# EAGLE design single84 (EAGLE 6.6.0)
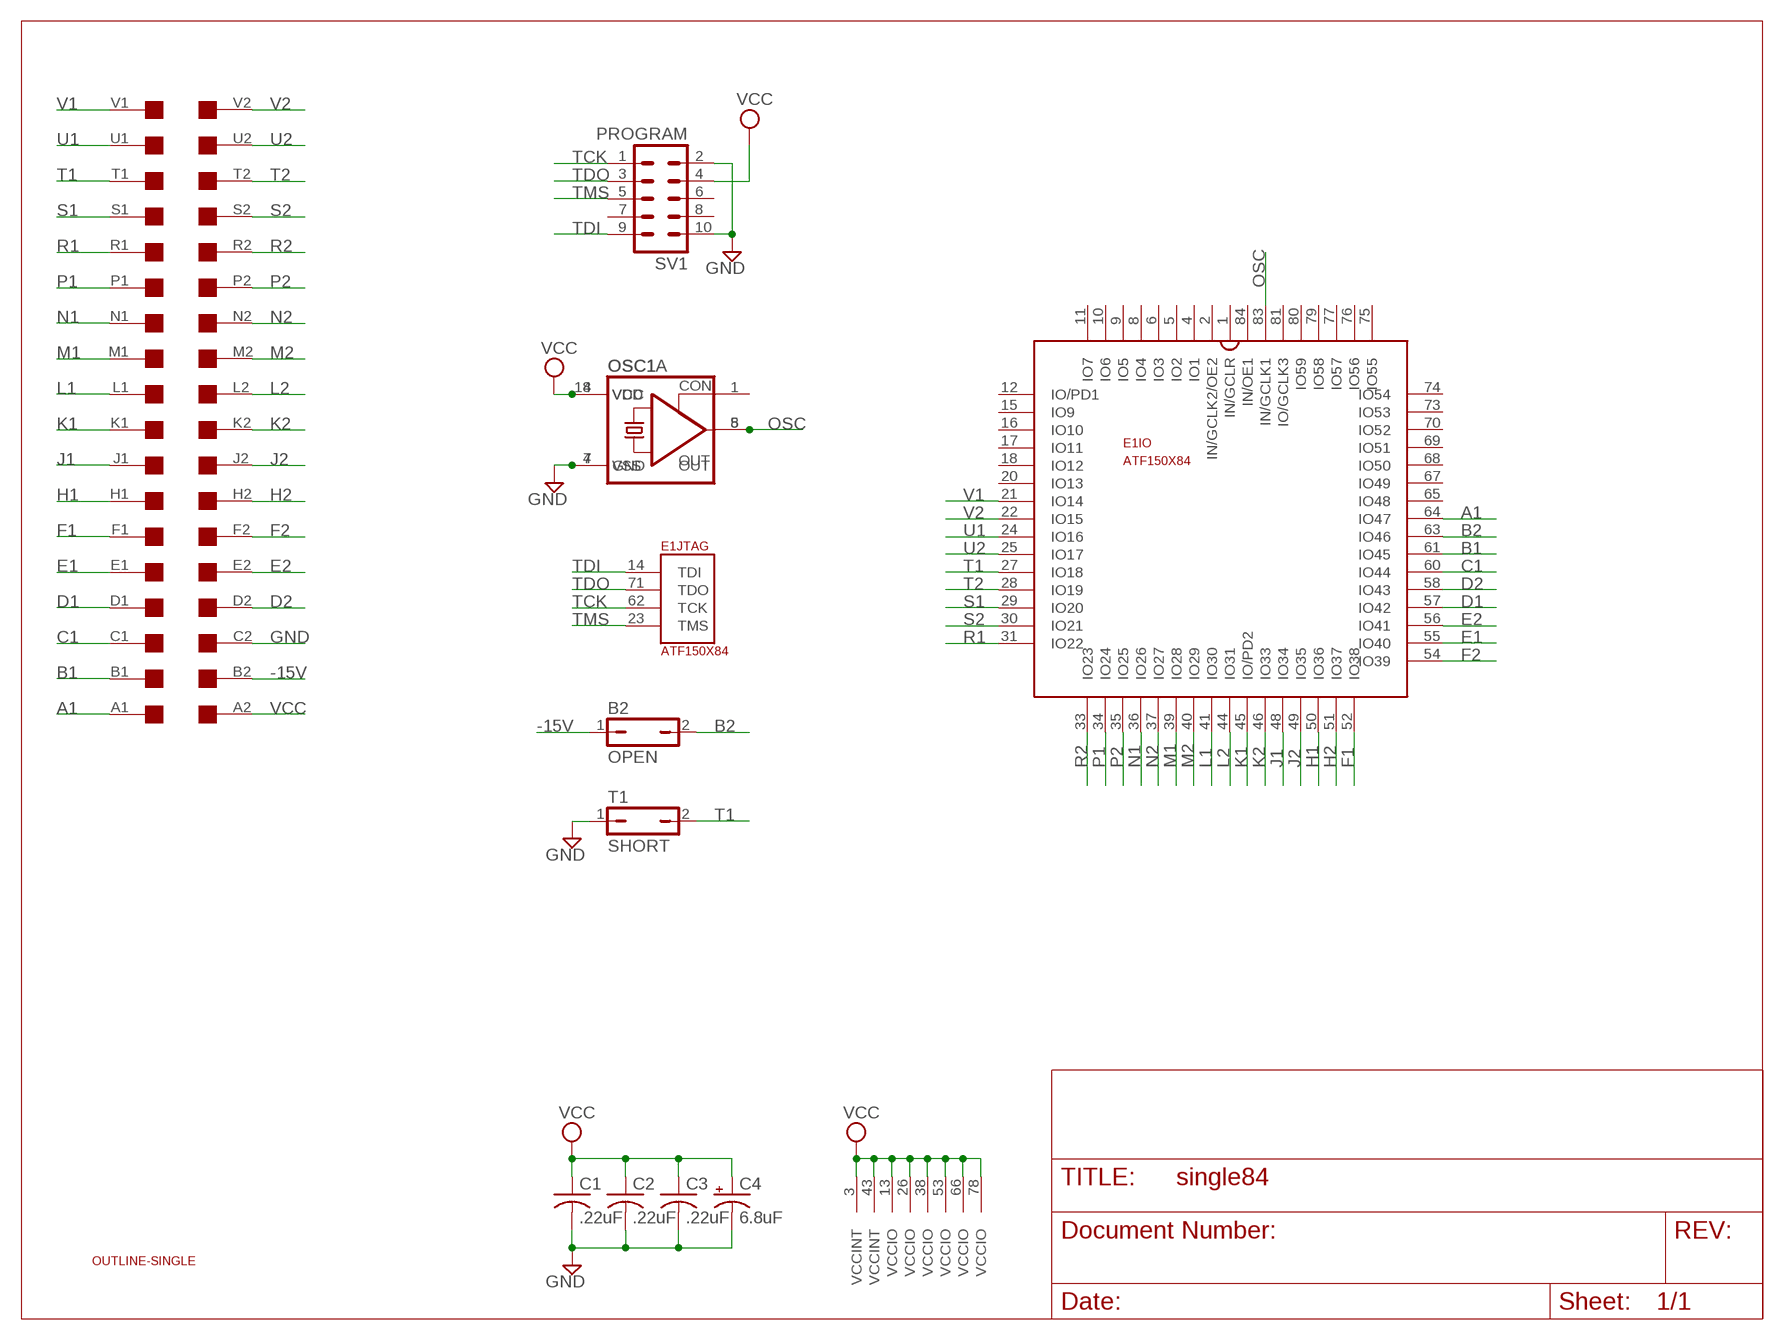
[diagram p0: schematic, sheet 1]

## Parts
B2  OPEN  JP1Q  [JP1]
C1  .22uF  C-US050-025X075  [C050-025X075]
C2  .22uF  C-US050-025X075  [C050-025X075]
C3  .22uF  C-US050-025X075  [C050-025X075]
C4  6.8uF  CPOL-USE15-5AXIAL  [E15-5]
E1  ATF150X84  [S84]
OSC1  QG5460  [DIL08S]
OSC1A  CRYSTAL_RES-SG51  [SG51]
SV1  PROGRAM  ML10  [ML10]
T1  SHORT  JP1Q  [JP1]
U$1  OUTLINE-SINGLE  [SINGLE]
U$2  SINGLE  [EDGE-CON2]

## Nets
-15V: B2.1 U$2.B2
A1: E1.64(IO:IO47) U$2.A1
B1: E1.61(IO:IO45) U$2.B1
B2: B2.2 E1.63(IO:IO46)
C1: E1.60(IO:IO44) U$2.C1
D1: E1.57(IO:IO42) U$2.D1
D2: E1.58(IO:IO43) U$2.D2
E1: E1.55(IO:IO40) U$2.E1
E2: E1.56(IO:IO41) U$2.E2
F1: E1.52(IO:IO38) U$2.F1
F2: E1.54(IO:IO39) U$2.F2
GND: C1.2 C2.2 C3.2 C4.- OSC1.4(GND) OSC1A.7(VSS) SV1.2 SV1.10 T1.1 U$2.C2
H1: E1.50(IO:IO36) U$2.H1
H2: E1.51(IO:IO37) U$2.H2
J1: E1.48(IO:IO34) U$2.J1
J2: E1.49(IO:IO35) U$2.J2
K1: E1.45(IO:IO/PD2) U$2.K1
K2: E1.46(IO:IO33) U$2.K2
L1: E1.41(IO:IO30) U$2.L1
L2: E1.44(IO:IO31) U$2.L2
M1: E1.39(IO:IO28) U$2.M1
M2: E1.40(IO:IO29) U$2.M2
N1: E1.36(IO:IO26) U$2.N1
N2: E1.37(IO:IO27) U$2.N2
OSC: E1.83(IO:IN/GCLK1) OSC1.5(OUT) OSC1A.8(OUT)
P1: E1.34(IO:IO24) U$2.P1
P2: E1.35(IO:IO25) U$2.P2
R1: E1.31(IO:IO22) U$2.R1
R2: E1.33(IO:IO23) U$2.R2
S1: E1.29(IO:IO20) U$2.S1
S2: E1.30(IO:IO21) U$2.S2
T1: E1.27(IO:IO18) T1.2 U$2.T1
T2: E1.28(IO:IO19) U$2.T2
TCK: E1.62(JTAG:TCK) SV1.1
TDI: E1.14(JTAG:TDI) SV1.9
TDO: E1.71(JTAG:TDO) SV1.3
TMS: E1.23(JTAG:TMS) SV1.5
U1: E1.24(IO:IO16) U$2.U1
U2: E1.25(IO:IO17) U$2.U2
V1: E1.21(IO:IO14) U$2.V1
V2: E1.22(IO:IO15) U$2.V2
VCC: C1.1 C2.1 C3.1 C4.+ E1.3(VCCINT) E1.13(VCCIO) E1.26(VCCIO) E1.38(VCCIO) E1.43(VCCINT) E1.53(VCCIO) E1.66(VCCIO) E1.78(VCCIO) OSC1.8(VCC) OSC1A.14(VDD) SV1.4 U$2.A2
Unconnected: E1.1(IO:IN/GCLR) E1.2(IO:IN/GCLK2/OE2) E1.4(IO:IO1) E1.5(IO:IO2) E1.6(IO:IO3) E1.8(IO:IO4) E1.9(IO:IO5) E1.10(IO:IO6) E1.11(IO:IO7) E1.12(IO:IO/PD1) E1.15(IO:IO9) E1.16(IO:IO10) E1.17(IO:IO11) E1.18(IO:IO12) E1.20(IO:IO13) E1.65(IO:IO48) E1.67(IO:IO49) E1.68(IO:IO50) E1.69(IO:IO51) E1.70(IO:IO52) E1.73(IO:IO53) E1.74(IO:IO54) E1.75(IO:IO55) E1.76(IO:IO56) E1.77(IO:IO57) E1.79(IO:IO58) E1.80(IO:IO59) E1.81(IO:IO/GCLK3) E1.84(IO:IN/OE1) OSC1A.1(CON) SV1.6 SV1.7 SV1.8

## Power pins joined to a net without a drawn wire
GND: E1.7(GND) E1.19(GND) E1.32(GND) E1.42(GND) E1.47(GND) E1.59(GND) E1.72(GND) E1.82(GND)

## Library data of the parts
B2 T1 = jumper:JP1Q: JUMPER
C1-C3 = rcl:C-US: CAPACITOR, American symbol
C4 = dec-con:CPOL-USE15-5AXIAL: 0.6" version of an electrolytic
E1 = atmel-cpld:ATF150X84: ATF150x in 84 pin package.
OSC1 = crystal:QG5460: CRYSTAL RESONATOR; OC_FARNELL: unknown; OC_NEWARK: unknown
OSC1A = crystal:CRYSTAL_RES-: CRYSTAL RESONATOR; OC_FARNELL: unknown; OC_NEWARK: unknown
SV1 = con-harting-ml:ML10: HARTING; OC_FARNELL: unknown; OC_NEWARK: unknown
U$1 = dec-con:OUTLINE-*: Board outlines for DEC boards.
U$2 = dec-con:SINGLE: Single-Height DEC board

## Net classes
1 Supply: width 0.711 mm

## Board
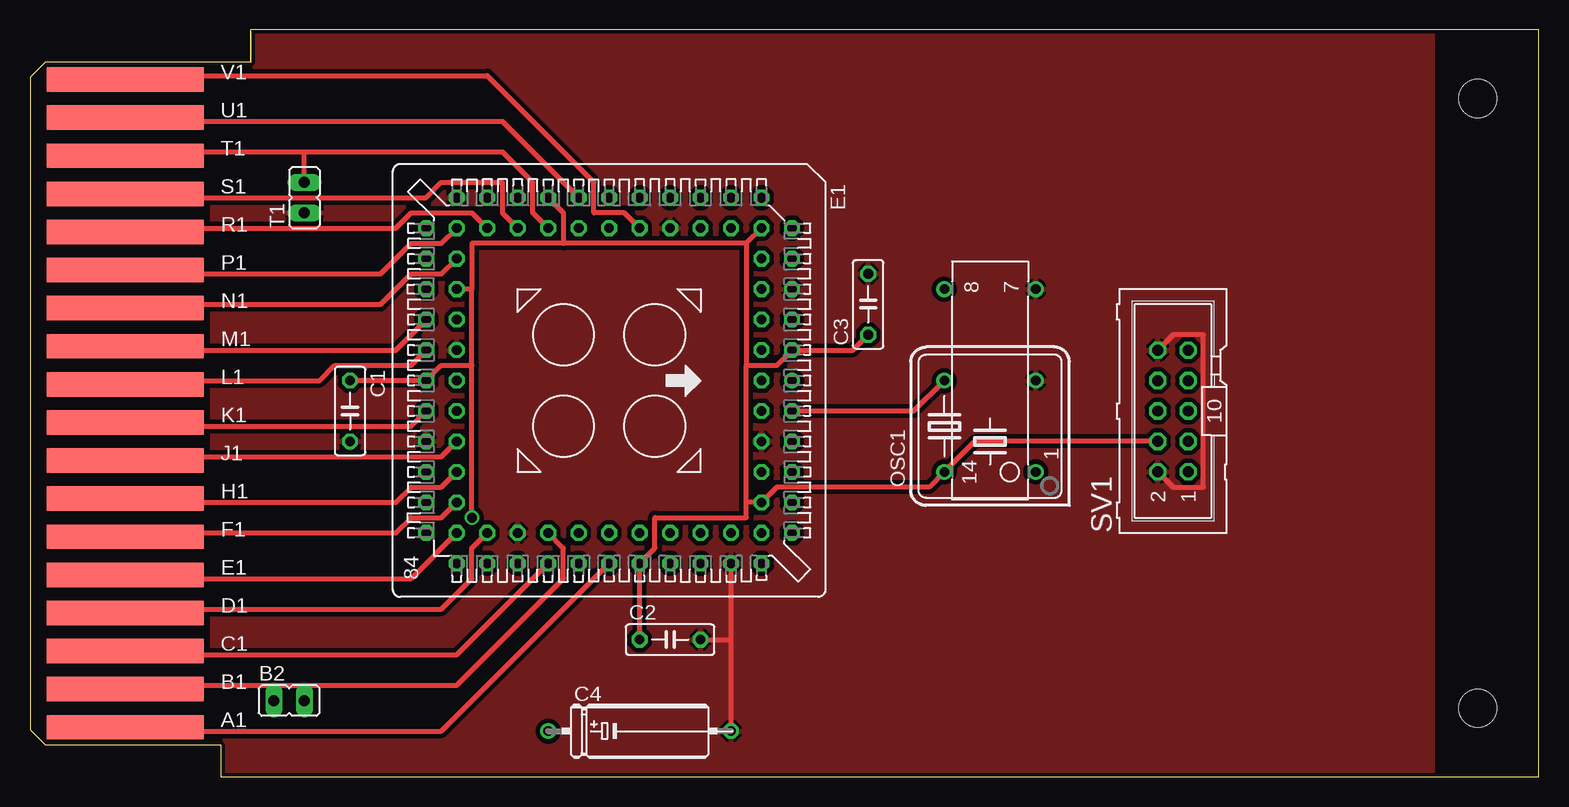
[diagram p1: board, top side]
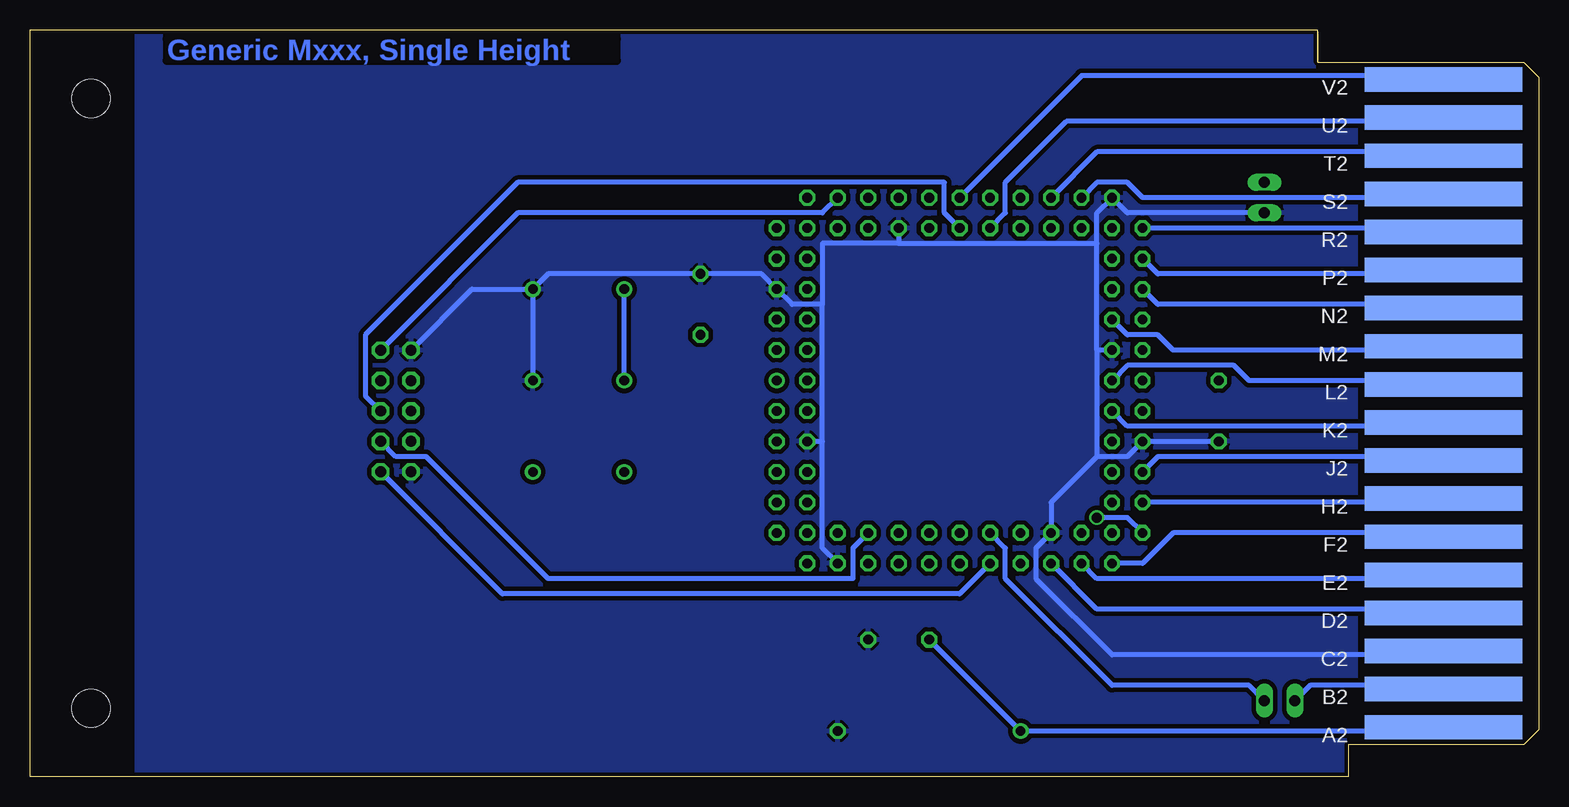
[diagram p2: board, bottom side, seen from below]

Size 125.73 x 62.23 mm. Coordinates in mm from the lower left corner, seen from the top.
Copper layers (1+16): Top 0.035mm / dielectric 1.5mm / Bottom 0.035mm
Design rules "16mils": minimum track width 16mil, minimum drill 32mil, track to track 15mil, track to pad 10mil, pad to pad 10mil, via to via 10mil, smd to smd 10mil, copper to edge 13mil, drill to drill 10mil, minimum pad ring 10mil, minimum via ring 8mil, stop-mask expansion 0mil, vias tented up to drill 0mil, thermal gap 10mil

### Footprints (pad centres in the part's own frame; a part is rotated, then mirrored left to right if it is on the bottom)
JP1 = drill 0.914 long: 1 0,-1.27; 2 0,1.27
C050-025X075 = drill 0.813 octagon: 1 -2.54,0; 2 2.54,0
E15-5 = drill 0.813: + -7.62,0 | drill 0.813 octagon: - 7.62,0
S84 = drill 0.813: 1 0,15.24 | drill 0.813 octagon: 2 0,12.7; 3 -2.54,15.24; 4 -2.54,12.7; 5 -5.08,15.24; 6 -5.08,12.7; 7 -7.62,15.24; 8 -7.62,12.7; 9 -10.16,15.24; 10 -10.16,12.7; 11 -12.7,15.24; 12 -15.24,12.7; 13 -12.7,12.7; 14 -15.24,10.16; 15 -12.7,10.16; 16 -15.24,7.62; 17 -12.7,7.62; 18 -15.24,5.08; 19 -12.7,5.08; 20 -15.24,2.54; 21 -12.7,2.54; 22 -15.24,0; 23 -12.7,0; 24 -15.24,-2.54; 25 -12.7,-2.54; 26 -15.24,-5.08; 27 -12.7,-5.08; 28 -15.24,-7.62; 29 -12.7,-7.62; 30 -15.24,-10.16; 31 -12.7,-10.16; 32 -15.24,-12.7; 33 -12.7,-15.24; 34 -12.7,-12.7; 35 -10.16,-15.24; 36 -10.16,-12.7; 37 -7.62,-15.24; 38 -7.62,-12.7; 39 -5.08,-15.24; 40 -5.08,-12.7; 41 -2.54,-15.24; 42 -2.54,-12.7; 43 0,-15.24; 44 0,-12.7; 45 2.54,-15.24; 46 2.54,-12.7; 47 5.08,-15.24; 48 5.08,-12.7; 49 7.62,-15.24; 50 7.62,-12.7; 51 10.16,-15.24; 52 10.16,-12.7; 53 12.7,-15.24; 54 15.24,-12.7; 55 12.7,-12.7; 56 15.24,-10.16; 57 12.7,-10.16; 58 15.24,-7.62; 59 12.7,-7.62; 60 15.24,-5.08; 61 12.7,-5.08; 62 15.24,-2.54; 63 12.7,-2.54; 64 15.24,0; 65 12.7,0; 66 15.24,2.54; 67 12.7,2.54; 68 15.24,5.08; 69 12.7,5.08; 70 15.24,7.62; 71 12.7,7.62; 72 15.24,10.16; 73 12.7,10.16; 74 15.24,12.7; 75 12.7,15.24; 76 12.7,12.7; 77 10.16,15.24; 78 10.16,12.7; 79 7.62,15.24; 80 7.62,12.7; 81 5.08,15.24; 82 5.08,12.7; 83 2.54,15.24; 84 2.54,12.7
DIL08S = drill 0.813: 1 -3.81,-3.81; 4 3.81,-3.81; 5 3.81,3.81; 8 -3.81,3.81
SG51 = drill 0.813: 1 -7.62,-3.81; 7 7.62,-3.81; 8 7.62,3.81; 14 -7.62,3.81
ML10 = drill 0.914 octagon: 1 -5.08,-1.27; 2 -5.08,1.27; 3 -2.54,-1.27; 4 -2.54,1.27; 5 0,-1.27; 6 0,1.27; 7 2.54,-1.27; 8 2.54,1.27; 9 5.08,-1.27; 10 5.08,1.27
SINGLE = hole 3.175: 120.65,56.515; 120.65,5.715
EDGE-CON2 = smd 13.106 x 2.032: A1 7.938,4.128; B1 7.938,7.303; C1 7.938,10.477; D1 7.938,13.652; E1 7.938,16.828; F1 7.938,20.003; H1 7.938,23.177; J1 7.938,26.352; K1 7.938,29.527; L1 7.938,32.703; M1 7.938,35.877; N1 7.938,39.053; P1 7.938,42.227; R1 7.938,45.403; S1 7.938,48.578; T1 7.938,51.752; U1 7.938,54.928; V1 7.938,58.102 | smd 13.106 x 2.032 bottom: A2 7.938,4.128; B2 7.938,7.303; C2 7.938,10.477; D2 7.938,13.652; E2 7.938,16.828; F2 7.938,20.003; H2 7.938,23.177; J2 7.938,26.352; K2 7.938,29.527; L2 7.938,32.703; M2 7.938,35.877; N2 7.938,39.053; P2 7.938,42.227; R2 7.938,45.403; S2 7.938,48.578; T2 7.938,51.752; U2 7.938,54.928; V2 7.938,58.102

### Placement (x,y rotation side)
B2  21.59,6.35 270 top
C1  26.67,30.48 270 top
C2  53.34,11.43 0 top
C3  69.85,39.37 90 top
C4  50.8,3.81 0 top
E1  48.26,33.02 270 top
OSC1  80.01,29.21 90 top
OSC1A  80.01,33.02 90 top
SV1  95.25,30.48 90 top
T1  22.86,48.26 0 top
U$1  0,0 0 top
U$2  0,0 0 top

### Tracks (layer width: path | path; a pad name or v marks a point on that pad's centre or on a via)
-15V
  Bottom 0.406: U$2.B2 8.26,7.62 19.05,7.62 B2.1
A1
  Top 0.406: U$2.A1 8.57,4.13 8.89,3.81 34.29,3.81 E1.64
B1
  Top 0.406: U$2.B1 8.57,7.3 8.89,7.62 35.56,7.62 44.45,16.51 44.45,19.05 E1.61
B2
  Bottom 0.406: B2.2 24.13,7.62 35.56,7.62 44.45,16.51 44.45,19.05 E1.63
C1
  Top 0.406: U$2.C1 8.57,10.48 8.89,10.16 35.56,10.16 E1.60
D1
  Top 0.406: U$2.D1 8.57,13.65 8.89,13.97 34.29,13.97 36.83,16.51 36.83,19.05 E1.57
D2
  Bottom 0.406: U$2.D2 8.57,13.65 8.89,13.97 36.83,13.97 E1.58
E1
  Top 0.406: U$2.E1 8.26,16.51 31.75,16.51 E1.55
E2
  Bottom 0.406: U$2.E2 8.26,16.51 36.83,16.51 E1.56
F1
  Top 0.406: U$2.F1 7.62,20.32 30.48,20.32 31.75,21.59 34.29,21.59 E1.52
F2
  Bottom 0.406: U$2.F2 8.26,20.32 30.48,20.32 33.02,17.78 E1.54
GND
  Top 0.406: SV1.2 95.25,24.13 97.79,24.13 97.79,36.83 95.25,36.83 SV1.10 | C2.2 58.42,11.43 | 58.42,11.43 E1.72 | C4.- 58.42,11.43
  Bottom 0.406: OSC1A.7 OSC1.4 | U$2.C2 8.57,10.48 8.89,10.16 35.56,10.16 41.91,16.51 41.91,19.05 E1.59 40.64,22.86 36.83,26.67 | SV1.10 88.9,40.64 OSC1A.7 | T1.1 34.29,46.99 E1.32 36.83,46.99 36.83,44.45 | 36.83,26.67 34.29,26.67 E1.47 C1.2 | 36.83,35.56 36.83,26.67 | E1.42 36.83,35.56 | 36.83,35.56 36.83,44.45 | E1.19 53.34,44.45 | 53.34,44.45 36.83,44.45 | E1.72 59.69,19.05 59.69,27.94 | 59.69,27.94 59.69,39.37 | 59.69,39.37 62.23,39.37 E1.7 64.77,41.91 C3.2 82.55,41.91 OSC1A.7 | E1.82 59.69,27.94 | 53.34,44.45 59.69,44.45 59.69,39.37
  pour Top: 15.24,0 15.24,62.23 116.84,62.23 116.84,0
  pour Bottom: 15.24,0 15.24,62.23 116.84,62.23 116.84,0
H1
  Top 0.406: 7.62,22.86 U$2.H1 8.26,22.86 30.48,22.86 31.75,24.13 34.29,24.13 E1.50
H2
  Bottom 0.406: U$2.H2 8.26,22.86 E1.51
J1
  Top 0.406: U$2.J1 8.26,26.67 34.29,26.67 E1.48
J2
  Bottom 0.406: U$2.J2 8.26,26.67 31.75,26.67 E1.49
K1
  Top 0.406: U$2.K1 8.26,29.21 31.75,29.21 E1.45
K2
  Bottom 0.406: U$2.K2 8.26,29.21 34.29,29.21 E1.46
L1
  Top 0.406: U$2.L1 8.26,33.02 24.13,33.02 25.4,34.29 31.75,34.29 E1.41
L2
  Bottom 0.406: U$2.L2 8.26,33.02 24.13,33.02 25.4,34.29 34.29,34.29 E1.44
M1
  Top 0.406: U$2.M1 8.26,35.56 30.48,35.56 E1.39
M2
  Bottom 0.406: U$2.M2 8.26,35.56 30.48,35.56 31.75,36.83 34.29,36.83 E1.40
N1
  Top 0.406: U$2.N1 8.26,39.37 29.21,39.37 31.75,41.91 34.29,41.91 E1.36
N2
  Bottom 0.406: U$2.N2 8.26,39.37 31.75,39.37 E1.37
OSC
  Top 0.406: E1.83 73.66,30.48 OSC1.5
  Bottom 0.406: OSC1.5 OSC1A.8
P1
  Top 0.406: U$2.P1 8.26,41.91 29.21,41.91 31.75,44.45 34.29,44.45 E1.34
P2
  Bottom 0.406: U$2.P2 8.26,41.91 31.75,41.91 E1.35
R1
  Top 0.406: U$2.R1 8.26,45.72 30.48,45.72 31.75,46.99 36.83,46.99 E1.31
R2
  Bottom 0.406: U$2.R2 8.26,45.72 E1.33
S1
  Top 0.406: U$2.S1 8.26,48.26 33.02,48.26 34.29,49.53 39.37,49.53 39.37,46.99 E1.29
S2
  Bottom 0.406: U$2.S2 8.26,48.26 33.02,48.26 34.29,49.53 36.83,49.53 E1.30
T1
  Top 0.406: U$2.T1 8.26,52.07 22.86,52.07 | 22.86,52.07 39.37,52.07 41.91,49.53 41.91,46.99 E1.27 | T1.2 22.86,52.07
T2
  Bottom 0.406: U$2.T2 8.26,52.07 36.83,52.07 E1.28
TCK
  Bottom 0.406: E1.62 48.26,15.24 86.36,15.24 SV1.1
TDI
  Bottom 0.406: E1.14 59.69,46.99 85.09,46.99 SV1.9
TDO
  Bottom 0.406: E1.71 57.15,19.05 57.15,16.51 82.55,16.51 92.71,26.67 95.25,26.67 SV1.3
TMS
  Bottom 0.406: E1.23 49.53,46.99 49.53,49.53 85.09,49.53 97.79,36.83 97.79,31.75 SV1.5
U1
  Top 0.406: U$2.U1 8.26,54.61 39.37,54.61 E1.24
U2
  Bottom 0.406: U$2.U2 8.26,54.61 39.37,54.61 44.45,49.53 44.45,46.99 E1.25
V1
  Top 0.406: U$2.V1 8.26,58.42 38.1,58.42 46.99,49.53 46.99,46.99 49.53,46.99 E1.21
V2
  Bottom 0.406: U$2.V2 8.26,58.42 38.1,58.42 E1.22
VCC  (via drill 0.81)
  Top 0.406: SV1.4 78.74,27.94 OSC1.8 74.93,24.13 62.23,24.13 E1.78 59.69,22.86 | 36.83,34.29 34.29,34.29 E1.43 C1.1 | 36.83,34.29 36.83,40.64 | 36.83,40.64 E1.38 | E1.26 44.45,46.99 44.45,44.45 | 44.45,44.45 36.83,44.45 36.83,40.64 | E1.13 59.69,44.45 | 59.69,44.45 44.45,44.45 | 59.69,22.86 59.69,21.59 52.07,21.59 52.07,19.05 E1.66 C2.1 | 59.69,22.86 59.69,34.29 | 59.69,34.29 62.23,34.29 E1.3 68.58,35.56 C3.1 | 59.69,44.45 59.69,34.29 | v36.83,21.59 36.83,34.29
  Bottom 0.406: U$2.A2 7.62,3.81 C4.+ C2.1 | E1.53 34.29,21.59 v36.83,21.59

### Text on the board
Bottom: Generic Mxxx, Single Height